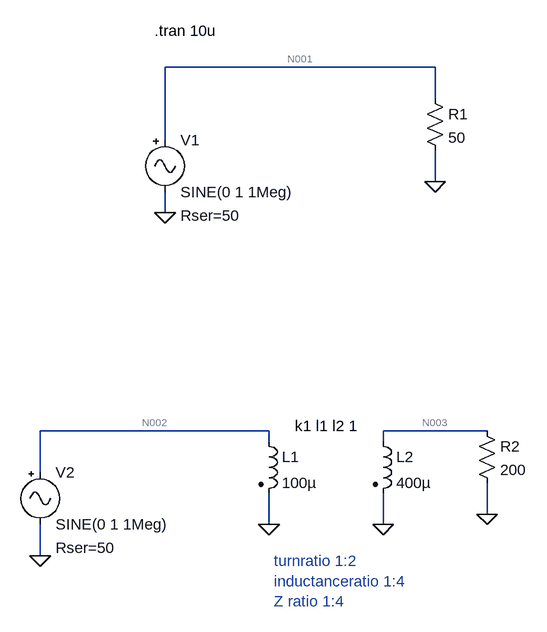
[diagram p0: schematic Draft3.asc]
Draft3.asc, the LTspice schematic file:
Version 4
SHEET 1 880 784
WIRE 448 -48 32 -48
WIRE 448 0 448 -48
WIRE 32 64 32 -48
WIRE 448 128 448 80
WIRE 32 176 32 144
WIRE 192 512 -160 512
WIRE 528 512 368 512
WIRE 192 528 192 512
WIRE 368 528 368 512
WIRE -160 576 -160 512
WIRE 528 640 528 592
WIRE 192 656 192 608
WIRE 368 656 368 608
WIRE -160 704 -160 656
FLAG 32 176 0
FLAG 448 128 0
FLAG -160 704 0
FLAG 192 656 0
FLAG 368 656 0
FLAG 528 640 0
SYMBOL Misc\\signal 32 48 R0
WINDOW 123 0 0 Left 0
WINDOW 39 24 132 Left 2
SYMATTR InstName V1
SYMATTR Value SINE(0 1 1Meg)
SYMATTR SpiceLine Rser=50
SYMBOL res 432 -16 R0
SYMATTR InstName R1
SYMATTR Value 50
SYMBOL Misc\\signal -160 560 R0
WINDOW 123 0 0 Left 0
WINDOW 39 24 132 Left 2
SYMATTR InstName V2
SYMATTR Value SINE(0 1 1Meg)
SYMATTR SpiceLine Rser=50
SYMBOL ind2 176 512 R0
SYMATTR InstName L1
SYMATTR Value 100µ
SYMATTR Type ind
SYMBOL ind2 352 512 R0
SYMATTR InstName L2
SYMATTR Value 400µ
SYMATTR Type ind
SYMBOL res 512 496 R0
SYMATTR InstName R2
SYMATTR Value 200
TEXT 16 -104 Left 2 !.tran 10u
TEXT 200 712 Left 2 ;turnratio 1:2\ninductanceratio 1:4\nZ ratio 1:4
TEXT 232 504 Left 2 !k1 l1 l2 1

The netlist it stands for:
* Draft3.asc
V1 N001 0 SINE(0 1 1Meg) Rser=50
R1 N001 0 50
V2 N002 0 SINE(0 1 1Meg) Rser=50
L1 N002 0 100µ
L2 N003 0 400µ
R2 N003 0 200
.tran 10u
* turnratio 1:2
* inductanceratio 1:4
* Z ratio 1:4
k1 l1 l2 1
.backanno
.end

* Results of the author's LTspice run, read from the files saved beside the schematic
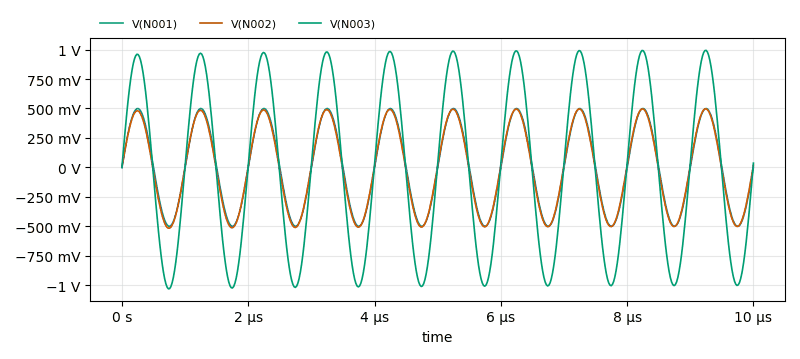
[diagram p1: Transient Analysis of Draft3.asc, plotted from the saved traces]
* Transient Analysis, 1 run:
*   V(N001): min -500 mV, max 500 mV, average -372.4 nV, rms 353.5 mV, last 0 V
*   V(N002): min -515.5 mV, max 497.1 mV, average -7.291 mV, rms 353 mV, last 18.23 mV
*   V(N003): min -1.03 V, max 993.3 mV, average -14.58 mV, rms 705.3 mV, last 36.45 mV